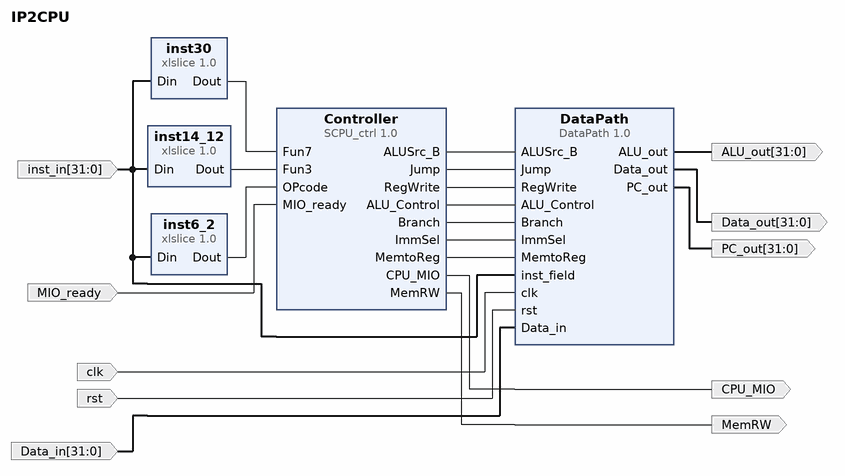
[diagram p0: block diagram of the top level]
# Vivado block design IP2CPU, xc7k160tffg676-2L, Vivado 2017.4
create_bd_design IP2CPU

create_bd_port -dir I MIO_ready
create_bd_port -dir I -type clk clk
set_property -dict {CONFIG.ASSOCIATED_RESET rst} [get_bd_ports clk]
create_bd_port -dir I -type rst rst
set_property -dict {CONFIG.POLARITY ACTIVE_HIGH} [get_bd_ports rst]
create_bd_port -dir I -from 31 -to 0 Data_in
create_bd_port -dir I -from 31 -to 0 inst_in
create_bd_port -dir O -from 31 -to 0 ALU_out
create_bd_port -dir O -from 31 -to 0 Data_out
create_bd_port -dir O -from 31 -to 0 PC_out
create_bd_port -dir O MemRW
create_bd_port -dir O CPU_MIO

create_bd_cell -type ip -vlnv xilinx.com:user:SCPU_ctrl:1.0 Controller
create_bd_cell -type ip -vlnv xilinx.com:user:DataPath:1.0 DataPath
create_bd_cell -type ip -vlnv xilinx.com:ip:xlslice:1.0 inst6_2
set_property -dict {CONFIG.DIN_TO 2 CONFIG.DIN_FROM 6 CONFIG.DOUT_WIDTH 5} [get_bd_cells inst6_2]
create_bd_cell -type ip -vlnv xilinx.com:ip:xlslice:1.0 inst14_12
set_property -dict {CONFIG.DIN_TO 12 CONFIG.DIN_FROM 14 CONFIG.DOUT_WIDTH 3} [get_bd_cells inst14_12]
create_bd_cell -type ip -vlnv xilinx.com:ip:xlslice:1.0 inst30
set_property -dict {CONFIG.DIN_TO 30 CONFIG.DIN_FROM 30 CONFIG.DOUT_WIDTH 1} [get_bd_cells inst30]

# ---- connections ----

connect_bd_net [get_bd_pins inst6_2/Dout] [get_bd_pins Controller/OPcode]
connect_bd_net [get_bd_pins inst14_12/Dout] [get_bd_pins Controller/Fun3]
connect_bd_net [get_bd_pins inst30/Dout] [get_bd_pins Controller/Fun7]
connect_bd_net -net MIO_ready_0_1 [get_bd_ports MIO_ready] [get_bd_pins Controller/MIO_ready]
connect_bd_net [get_bd_pins Controller/ALUSrc_B] [get_bd_pins DataPath/ALUSrc_B]
connect_bd_net [get_bd_pins Controller/Jump] [get_bd_pins DataPath/Jump]
connect_bd_net [get_bd_pins Controller/RegWrite] [get_bd_pins DataPath/RegWrite]
connect_bd_net -net clk_0_1 [get_bd_ports clk] [get_bd_pins DataPath/clk]
connect_bd_net -net rst_0_1 [get_bd_ports rst] [get_bd_pins DataPath/rst]
connect_bd_net [get_bd_pins Controller/ALU_Control] [get_bd_pins DataPath/ALU_Control]
connect_bd_net [get_bd_pins Controller/Branch] [get_bd_pins DataPath/Branch]
connect_bd_net -net Data_in_0_1 [get_bd_ports Data_in] [get_bd_pins DataPath/Data_in]
connect_bd_net [get_bd_pins Controller/ImmSel] [get_bd_pins DataPath/ImmSel]
connect_bd_net [get_bd_pins Controller/MemtoReg] [get_bd_pins DataPath/MemtoReg]
connect_bd_net [get_bd_ports inst_in] [get_bd_pins DataPath/inst_field] [get_bd_pins inst6_2/Din] [get_bd_pins inst14_12/Din] [get_bd_pins inst30/Din]
connect_bd_net [get_bd_pins DataPath/ALU_out] [get_bd_ports ALU_out]
connect_bd_net [get_bd_pins DataPath/Data_out] [get_bd_ports Data_out]
connect_bd_net [get_bd_pins DataPath/PC_out] [get_bd_ports PC_out]
connect_bd_net [get_bd_pins Controller/MemRW] [get_bd_ports MemRW]
connect_bd_net [get_bd_pins Controller/CPU_MIO] [get_bd_ports CPU_MIO]

validate_bd_design
save_bd_design
